# EAGLE design 6d (EAGLE 6.4)
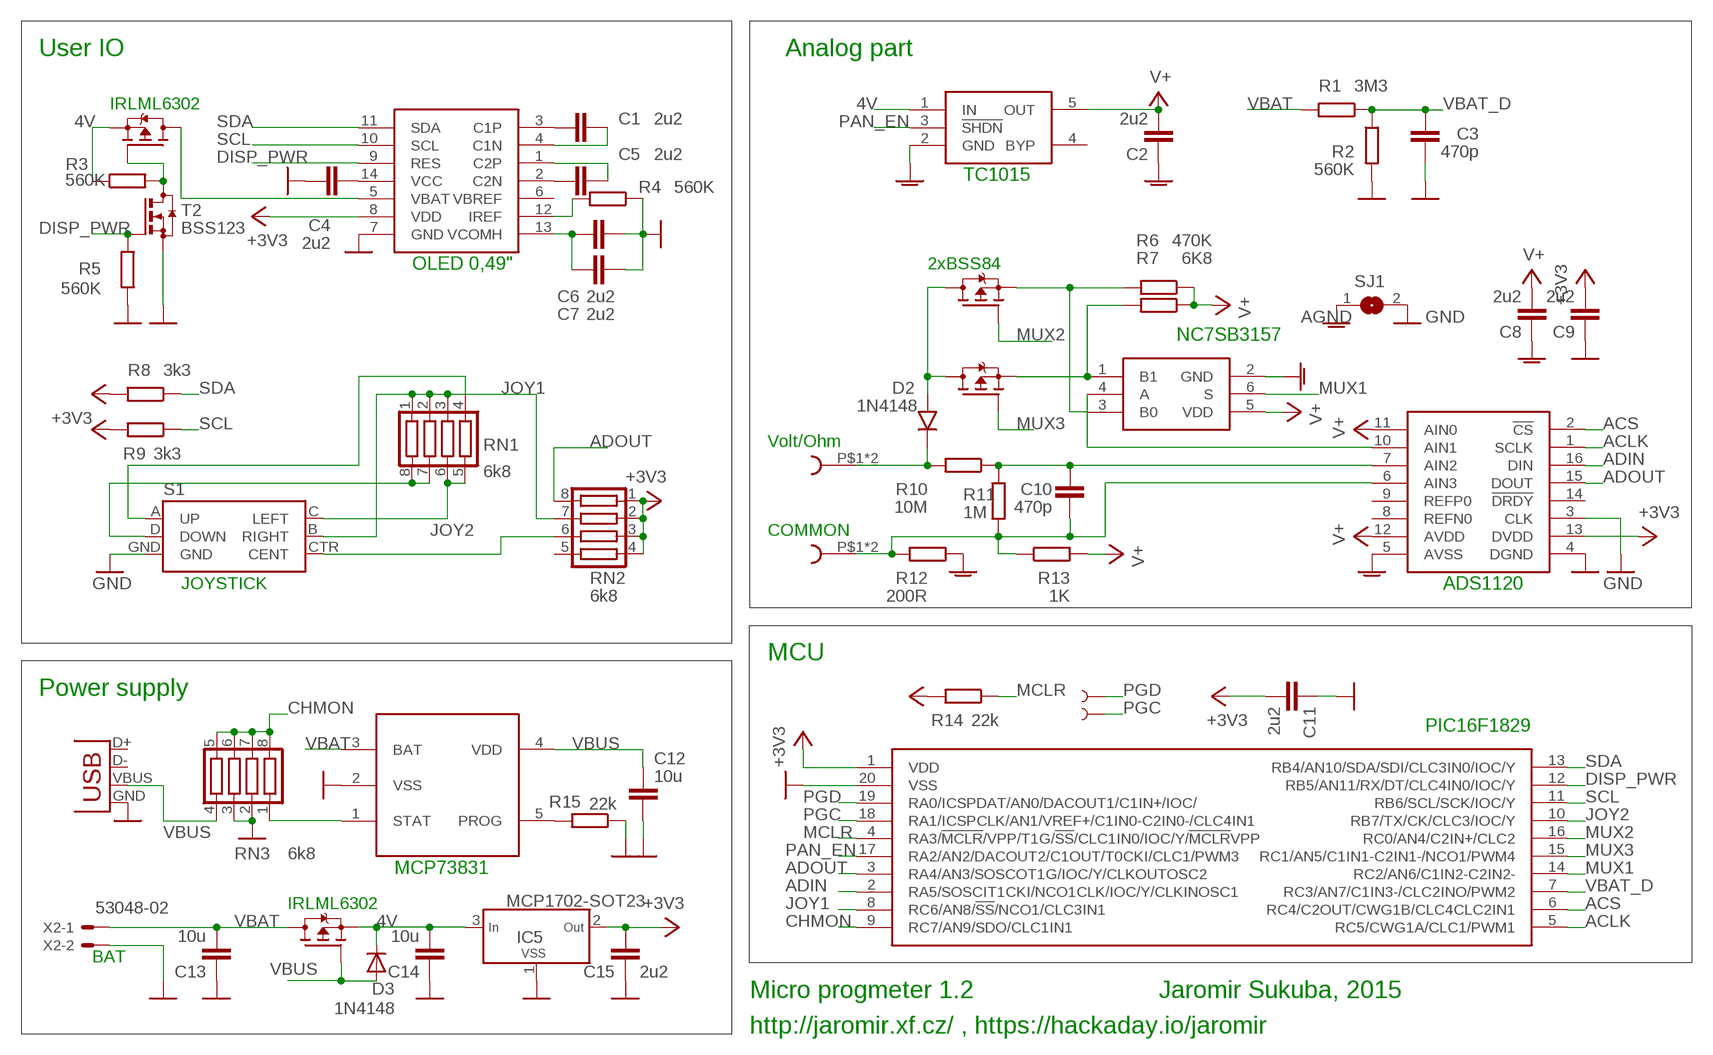
[diagram p0: schematic, sheet 1]

## Parts
C1  2u2  C_0603  [0603]
C2  2u2  C_0603  [0603]
C3  470p  C_0603  [0603]
C4  2u2  C_0603  [0603]
C5  2u2  C_0603  [0603]
C6  2u2  C_0603  [0603]
C7  2u2  C_0603  [0603]
C8  2u2  C_0603  [0603]
C9  2u2  C_0603  [0603]
C10  470p  C_0603  [0603]
C11  2u2  C_0603  [0603]
C12  10u  C_0806  [R0805]
C13  10u  C_0806  [R0805]
C14  10u  C_0806  [R0805]
C15  2u2  C_0603  [0603]
D1  DISP_OLED_049B  [DISP_OLED_049_B]
D2  1N4148  1N4148SOD  [SOD-80]
D3  1N4148  DIODE-SOD123  [SOD123]
IC1  TC1015  [SOT23-5]
IC2  NC7SB3157  [SC70-6]
IC3  ADS1120  [TSSOP16]
IC4  PIC16F1508SSOP20  [SSOP20]
IC5  MCP1702-SOT23  [SOT23]
R1  3M3  R_0603  [0603]
R2  560K  R_0603  [0603]
R3  560K  R_0603  [0603]
R4  560K  R_0603  [0603]
R5  560K  R_0603  [0603]
R6  470K  R_0805  [R0805]
R7  6K8  R_0805  [R0805]
R8  3k3  R_0603  [0603]
R9  3k3  R_0603  [0603]
R10  10M  R_0805  [R0805]
R11  1M  R_0805  [R0805]
R12  200R  R_0603  [0603]
R13  1K  R_0603  [0603]
R14  22k  R_0603  [0603]
R15  22k  R_0603  [0603]
RN1  6k8  CTS742C083  [CTS742C083]
RN2  6k8  CTS742C083  [CTS742C083]
RN3  6k8  CTS742C083  [CTS742C083]
S1  JOYSTICK_MINI  [JOYSTICK_MINI]
SJ1  SJ  [SJ]
T1  BSS84  [SOT23-3]
T2  BSS123  [SOT23]
T3  BSS84  [SOT23-3]
T4  BSS84  [SOT23-3]
T5  BSS84  [SOT23-3]
TP1  TEST-POINT3X5  [PAD.03X.05]
TP2  TEST-POINT3X5  [PAD.03X.05]
U$1  BANPLUG_2  [BANPLUG_2]
U$2  BANPLUG_2  [BANPLUG_2]
U$3  MCP73831  [SOT23-5]
X1  USB-MICROB  [USB-MICROB]
X2  53048-02  [53048-02]

## Nets
4V: C14.2 D3.C IC1.1(IN) IC5.3(IN) R3.1 T1.2(S) T5.2(S)
+3V3: C9.2 C11.2 C15.2 D1.8(VDD) IC3.13(DVDD) IC4.1(VDD) IC5.2(OUT) R8.2 R9.2 R14.2 RN2.1 RN2.2 RN2.3 RN2.4
ACLK: IC3.1(SCLK) IC4.5(RC5/CWG1A/CLC1/PWM1)
ACS: IC3.2(!CS) IC4.6(RC4/C2OUT/CWG1B/CLC4CLC2IN1)
ADIN: IC3.16(DIN) IC4.2(RA5/SOSCIT1CKI/NCO1CLK/IOC/Y/CLKINOSC1)
ADOUT: IC3.15(DOUT) IC4.3(RA4/AN3/SOSCOT1G/IOC/Y/CLKOUTOSC2) RN2.8
AGND: C2.1 C8.1 IC1.2(GND) IC2.2(GND) IC3.5(AVSS) R12.1 SJ1.1
CHMON: IC4.9(RC7/AN9/SDO/CLC1IN1) RN3.5 RN3.6 RN3.7 RN3.8
DISP_PWR: D1.9(RES) IC4.12(RB5/AN11/RX/DT/CLC4IN0/IOC/Y) R5.2 T2.1(G)
GND: C3.1 C4.1 C6.2 C7.2 C9.1 C11.1 C12.2 C13.1 C14.1 C15.1 D1.7(GND) IC3.3(CLK) IC3.4(DGND) IC4.20(VSS) IC5.1(VSS) R2.2 R4.1 R5.1 R15.1 RN3.2 RN3.3 S1.GND SJ1.2 T2.2(S) U$3.2(VSS) X1.GND X2.2
JOY1: IC4.8(RC6/AN8/!SS!/NCO1/CLC3IN1) RN1.1 RN1.2 RN1.3 RN2.7 S1.B(RIGHT)
JOY2: IC4.10(RB7/TX/CK/CLC3/IOC/Y) RN2.6 S1.CTR(CENT)
MCLR: IC4.4(RA3/!MCLR!/VPP/T1G/!SS!/CLC1IN0/IOC/Y/!MCLR!VPP) R14.1
MUX1: IC2.6(S) IC4.14(RC2/AN6/C1IN2-C2IN2-)
MUX2: IC4.16(RC0/AN4/C2IN+/CLC2) T3.1(G)
MUX3: IC4.15(RC1/AN5/C1IN1-C2IN1-/NCO1/PWM4) T4.1(G)
N$2: IC2.1(B1) R7.2 T4.2(S)
N$3: IC2.3(B0) R6.2 T3.2(S)
N$5: IC2.4(A) IC3.10(AIN1)
N$6: D2.K R10.2 U$1.P$1 U$1.P$2
N$7: R3.2 T1.1(G) T2.3(D)
N$8: C10.2 IC3.7(AIN2) R10.1 R11.1
N$9: RN3.1 U$3.1(STAT)
N$10: C10.1 IC3.6(AIN3) R11.2 R12.2 R13.1 U$2.P$1 U$2.P$2
N$11: C4.2 D1.14(VCC)
N$12: D1.5(VBAT) T1.3(D)
N$13: C6.1 C7.1 D1.13(VCOMH)
N$14: D1.12(IREF) R4.2
N$15: D2.A T3.3(D) T4.3(D)
N$17: RN1.4 S1.A(UP)
N$18: C1.1 D1.3(C1P)
N$19: C5.1 D1.2(C2N)
N$20: C5.2 D1.1(C2P)
N$21: C1.2 D1.4(C1N)
N$30: RN1.5 RN1.6 S1.C(LEFT)
N$33: RN1.7 RN1.8 S1.D(DOWN)
N$78: R15.2 U$3.5(PROG)
PAN_EN: IC1.3(!SHDN) IC4.17(RA2/AN2/DACOUT2/C1OUT/T0CKI/CLC1/PWM3)
PGC: IC4.18(RA1/ICSPCLK/AN1/VREF+/C1IN0-C2IN0-/CLC4IN1) TP2.P$1
PGD: IC4.19(RA0/ICSPDAT/AN0/DACOUT1/C1IN+/IOC/) TP1.P$1
SCL: D1.10(SCL) IC4.11(RB6/SCL/SCK/IOC/Y) R9.1
SDA: D1.11(SDA) IC4.13(RB4/AN10/SDA/SDI/CLC3IN0/IOC/Y) R8.1
V+: C2.2 C8.2 IC1.5(OUT) IC2.5(VDD) IC3.11(AIN0) IC3.12(AVDD) R6.1 R7.1 R13.2
VBAT: C13.2 R1.2 T5.3(D) U$3.3(BAT) X2.1
VBAT_D: C3.2 IC4.7(RC3/AN7/C1IN3-/CLC2INO/PWM2) R1.1 R2.1
VBUS: C12.1 D3.A RN3.4 T5.1(G) U$3.4(VDD) X1.VBUS
Unconnected: D1.6(VBREF) IC1.4(BYP) IC3.8(REFN0) IC3.9(REFP0) IC3.14(!DRDY) RN2.5 X1.D+ X1.D-

## Notes on the sheet
- User IO | Analog part
- IRLML6302
- TC1015
- OLED 0,49" | 2xBSS84
- NC7SB3157
- Volt/Ohm
- COMMON
- JOYSTICK | ADS1120
- MCU
- Power supply
- PIC16F1829
- MCP73831
- IRLML6302
- BAT
- Micro progmeter 1.2 | Jaromir Sukuba, 2015
- http://jaromir.xf.cz/ , https://hackaday.io/jaromir

## Library data of the parts
C1-C15 = _moja:C
D1 = _moja:DISP_OLED_049
D2 = _mcom5:1N4148
D3 = diode:DIODE-: DIODE
IC1 = _moja:TC1015
IC2 = _mcom5:NC7SB3157
IC3 = _mcom5:ADS1120
IC4 = _mcom5:PIC16F1508
IC5 = _mcom4:MCP1702
R1-R15 = _moja:R
RN1-RN3 = resistor-net:CTS742C083: Chip Resistor Array 4 Single Resistor Source: http://www.ctscorp.com/components/Datasheets/CTSChipArrayDs.pdf
S1 = SparkFun-Electromechanical:JOYSTICK_MINI: Small 5-way tactile joystick, COM-10063 4UCON SF303GJ26
SJ1 = jumper:SJ: SMD solder JUMPER
T1 T3-T5 = _moja:BSS84
T2 = transistor-small-signal:BSS123: N-CHANNEL MOS FET
TP1 TP2 = SparkFun:TEST-POINT
U$1 U$2 = _moja:BANPLUG_2
U$3 = _moja:MCP73831
X1 = SparkFun:USB: USB Connectors USB-B-PTH is fully proven SKU : PRT-00139 USB-miniB is fully proven SKU : PRT-00587 USB-A-PCB is untested. USB-A-H is throughly reviewed, but untested. Spark Fun Electronics SKU : PRT-00437 USB-B-SMT is throughly reviewed, but untested. Needs silkscreen touching up. USB-A-S has not been used/tested USB-MB-H has not been used/tested
X2 = con-molex:53?-02: CONNECTOR wire to board 1.25 mm (.049 inch) pitch header

## Board
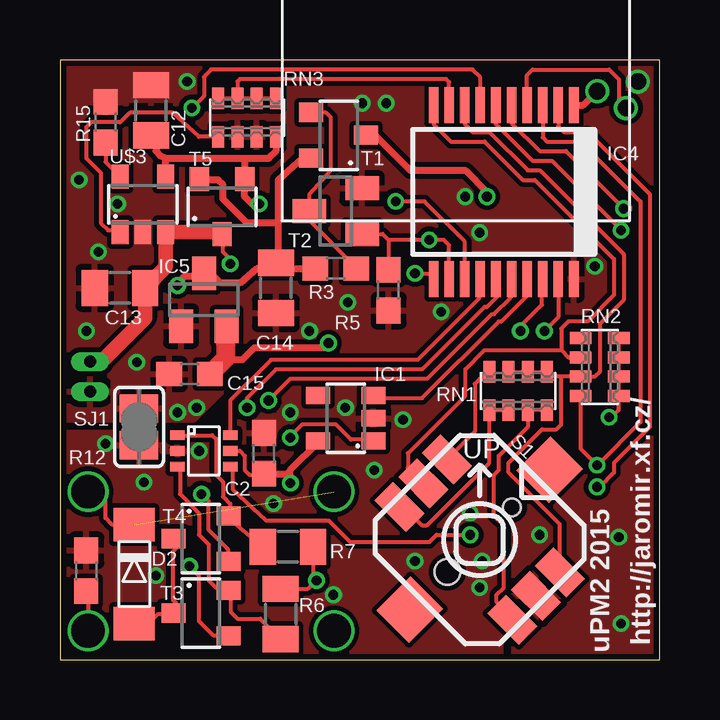
[diagram p1: board, top side]
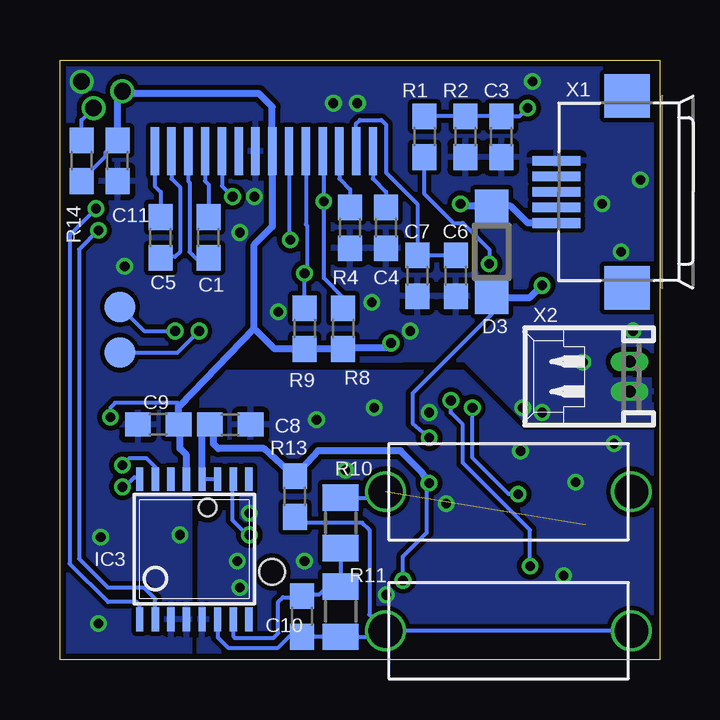
[diagram p2: board, bottom side, seen from below]

Size 25 x 25 mm. Coordinates in mm from the lower left corner, seen from the top.
Outline: 0,0 25,0 25,25 0,25 0,0
Copper layers (1*16): Top 0.035mm / dielectric 1.5mm / Bottom 0.035mm
Design rules "ch_6": minimum track width 0.15mm, minimum drill 0.4mm, track to track 0.2mm, track to pad 0.2mm, pad to pad 0.2mm, via to via 0.2mm, smd to smd 0.2mm, copper to edge 10mil, drill to drill 8mil, minimum pad ring 0.15mm, minimum via ring 0.15mm, stop-mask expansion 4mil, vias tented up to drill 0mil, thermal gap 10mil

### Footprints (pad centres in the part's own frame; a part is rotated, then mirrored left to right if it is on the bottom)
0603 = smd 1.067 x 1: 1 -0.85,0; 2 0.85,0
R0805 = smd 1.1 x 1.5: 1 -1.05,0; 2 1.05,0
DISP_OLED_049_B = smd 0.35 x 2 bottom: 1 4.55,-2.9; 2 3.85,-2.9; 3 3.15,-2.9; 4 2.45,-2.9; 5 1.75,-2.9; 6 1.05,-2.9; 7 0.35,-2.9; 8 -0.35,-2.9; 9 -1.05,-2.9; 10 -1.75,-2.9; 11 -2.45,-2.9; 12 -3.15,-2.9; 13 -3.85,-2.9; 14 -4.55,-2.9
SOD-80 = smd 1.397 x 1.702: A 1.905,0; K -2.223,0
SOD123 = smd 1.4 x 1.4: A 1.9,0; C -1.9,0
SOT23-5 = smd 0.7 x 1: 1 -0.99,-1.17; 2 -0.04,-1.17; 3 0.91,-1.17; 4 0.91,1.13; 5 -0.99,1.13
SC70-6 = smd 0.4 x 0.6: 1 -0.65,-1.1; 2 0,-1.1; 3 0.65,-1.1; 4 0.65,1.1; 5 0,1.1; 6 -0.65,1.1
TSSOP16 = smd 0.305 x 0.991: 1 -2.275,-2.918; 2 -1.625,-2.918; 3 -0.975,-2.918; 4 -0.325,-2.918; 5 0.325,-2.918; 6 0.975,-2.918; 7 1.625,-2.918; 8 2.275,-2.918; 9 2.275,2.918; 10 1.625,2.918; 11 0.975,2.918; 12 0.325,2.918; 13 -0.325,2.918; 14 -0.975,2.918; 15 -1.625,2.918; 16 -2.275,2.918
SSOP20 = smd 0.4 x 1.5: 1 -2.925,-3.625; 2 -2.275,-3.625; 3 -1.625,-3.625; 4 -0.975,-3.625; 5 -0.325,-3.625; 6 0.325,-3.625; 7 0.975,-3.625; 8 1.625,-3.625; 9 2.275,-3.625; 10 2.925,-3.625; 11 2.925,3.625; 12 2.275,3.625; 13 1.625,3.625; 14 0.975,3.625; 15 0.325,3.625; 16 -0.325,3.625; 17 -0.975,3.625; 18 -1.625,3.625; 19 -2.275,3.625; 20 -2.925,3.625
SOT23 = smd 1 x 1.4: 1 -0.95,-1.1; 2 0.95,-1.1; 3 0,1.1
CTS742C083 = smd 0.5 x 0.9: 1 -1.2,-0.8; 2 -0.4,-0.8; 3 0.4,-0.8; 4 1.2,-0.8; 5 1.2,0.8; 6 0.4,0.8; 7 -0.4,0.8; 8 -1.2,0.8
JOYSTICK_MINI = smd 1.85 x 1.1: A -3.325,1.4; B 3.325,1.4; C -3.325,-1.4; CTR -3.325,0; D 3.325,-1.4; GND 3.325,0 | smd 1.9 x 2: NC 0,4.13; NC@0 0,-4.13 | hole 0.75: 0,1.9 | hole 1.05: 0,-1.9
SJ = smd 1.168 x 1.6: 1 -0.762,0; 2 0.762,0
SOT23-3 = smd 0.8 x 1: 1 0.91,1.13; 2 -0.99,1.13; 3 -0.04,-1.17
PAD.03X.05 = smd 1.27 x 1.27: P$1 0,0
BANPLUG_2 = drill 1.4: P$1 -5.125,0; P$2 5.125,0
USB-MICROB = smd 0.4 x 2: D+ 0,3.1; D- -0.65,3.1; GND 1.3,3.1; ID 0.65,3.1; VBUS -1.3,3.1 | smd 1.8 x 1.9: GND@2 -4,0.15; GND@3 4,0.15
53048-02 = drill 0.5 pad 0.698 long: 1 0.625,-1.25; 2 -0.625,-1.25

### Placement (x,y rotation side)
C1  18.8,17.6 90 bottom
C2  8.5,8.6 270 top
C3  6.6,21.8 90 bottom
C4  11.4,18 90 bottom
C5  20.8,17.6 90 bottom
C6  8.5,16 270 bottom
C7  10.1,16 270 bottom
C8  17.9,9.8 180 bottom
C9  20.9,9.8 0 bottom
C10  14.9,1.8 90 bottom
C11  22.6,20.8 90 bottom
C12  3.8,22.9 90 top
C13  2.5,15.5 0 top
C14  9,15.5 90 top
C15  5.4,11.9 0 top
D1  16.5,24.1 0 top
D2  3.1,3.4 270 top
D3  7,17 90 bottom
IC1  11.9,10.1 90 top
IC2  6,8.7 270 top
IC3  19.4,4.6 0 bottom
IC4  18.5,19.5 180 top
IC5  6,15 0 top
R1  9.8,21.8 270 bottom
R2  8.1,21.8 270 bottom
R3  11.5,16.3 0 top
R4  12.9,18 90 bottom
R5  13.7,15.4 90 top
R6  9.2,1.9 270 top
R7  9.5,4.7 180 top
R8  13.2,13.8 270 bottom
R9  14.8,13.8 270 bottom
R10  13.3,5.7 90 bottom
R11  13.3,2 270 bottom
R12  1.1,3.7 270 top
R13  15.2,6.8 90 bottom
R14  24.1,20.8 270 bottom
R15  1.9,22.4 270 top
RN1  19.1,11.2 180 top
RN2  22.5,12.2 90 top
RN3  7.8,22.6 0 top
S1  17.5,5 315 top
SJ1  3.3,9.7 90 top
T1  11.6,21.9 90 top
T2  11.5,18.7 90 top
T3  5.9,1.9 270 top
T4  5.9,5 270 top
T5  6.8,18.9 0 top
TP1  22.5,14.7 0 bottom
TP2  22.5,12.8 0 bottom
U$1  6.3,7 180 bottom
U$2  6.3,1.2 0 bottom
U$3  3.5,19 0 top
X1  1.2,19.5 90 bottom
X2  2.5,11.8 90 bottom

### Tracks (layer width: path | path; a pad name or v marks a point on that pad's centre or on a via)
4V  (via drill 0.4)
  Top 0.16: IC1.1 12.67,9.17 12.13,9.17 11.5,9.8 10.1,9.8 9.6,9.3 v9.6,9.25 | 5.9,16 IC5.3
  Top 0.3: 8.95,16.3 8.2,16.3 7.5,15.7 6.7,15.7 6.4,16 6.1,16 IC5.3 | R3.1 9,16.3 C14.2 8.95,16.3 | T1.2 10.11,20.91 9.1,20 9.1,18.2 | v4.9,15.6 4.9,15.7 5.2,16 5.9,16 | 9.1,18.2 7.8,18.2 6.8,19.2 6.8,19.8 6.6,20 5.84,20 T5.2 6.04,20.1 | 9.1,18.2 9.1,16.45 8.95,16.3
  Bottom 0.16: 9.6,9.2 v9.6,9.25 10.3,9.85 10.3,11.1 7,14.4 D3.C
  Bottom 0.3: D3.C 5.4,15.1 v4.9,15.6
+3V3  (via drill 0.4, 0.7)
  Top 0.16: v22.9,10.1 23.3,10.4 RN2.1 RN2.2 RN2.3 RN2.4
  Top 0.3: 6.95,13.8 IC5.2 | IC4.1 21.82,23.12 v22.4,23.7 | 6.9,12.55 6.9,12.5 7.6,12.5 8.1,13 11,13 v11.2,13.2
  Top 0.8: 6.95,13.8 6.95,13.45 6.9,13.2 6.9,12.55 C15.2
  Bottom 0.16: 22.3,23.6 v22.4,23.7 | R14.2 24.1,20 23.1,21 23.1,21.15 C11.2 | 20,9.75 C9.2 | 20.05,10.6 20.05,10.65 20.1,10.7 22.7,10.7 22.9,10.5 v22.9,10.1
  Bottom 0.3: 22.3,23.6 16.7,23.6 16.15,23.05 D1.8 16.15,18.05 16.9,17.3 16.9,13.8 | C11.2 22.6,23.5 v22.4,23.7 | IC3.13 19.73,8.53 20,8.8 20,9.75 | C9.2 20.05,10.6 20,10.6 16.9,13.8 | v11.2,13.2 11.4,13 13.15,13 R8.2 R9.2 16.05,12.95 16.9,13.8
ACLK  (via drill 0.4)
  Top 0.16: IC4.5 18.82,22.38 20,21.2 21.1,21.2 v23.5,18.8
  Bottom 0.16: v23.5,18.8 24.6,17.7 24.6,4 23,2.4 21.8,2.4 21.68,2.27 IC3.1
ACS  (via drill 0.4)
  Top 0.16: IC4.6 18.18,22.32 19.7,20.8 20.5,20.8 v23.4,17.9
  Bottom 0.16: v23.4,17.9 24.2,17.1 24.2,4.2 23,3 21.5,3 21.02,2.52 IC3.2
ADIN  (via drill 0.4)
  Top 0.16: IC4.2 20.77,22.23 21,22 22,22 24.6,19.4 24.6,9.7 23.1,8.2 23.1,7.8 22.5,7.2 v22.4,7.2
  Bottom 0.16: v22.4,7.2 22.3,7.2 21.9,7.6 21.76,7.6 IC3.16
ADOUT  (via drill 0.4)
  Top 0.16: IC4.3 20.12,21.77 20.3,21.6 21.7,21.6 24.2,19.1 24.2,9.9 v22.4,8.1 21.7,8.8 RN2.8
  Bottom 0.16: v22.4,8.1 22.4,8.2 22.1,8.4 21.4,8.4 21.02,8.03 IC3.15
AGND  (via drill 0.4)
  other vias: 1.9,9 5.8,8.7 9.6,10.3 4,3.5 11.4,2.7 3.5,7.4 17.5,3 11.9,10.5 14.3,10 8.9,6.5 17.6,4.1 14.8,4.1 17.1,6.1 13.1,7.9
  pour Top: 0,0 18.4,0 18.4,12 9,12 6.5,9.5 0,9.5
  pour Bottom: 0,0 19.2,0 19.1,11.2 18.3,12 8.2,12 5.7,9.5 0,9.5
  pour Top (no thermals): 8.1,10.2 8.1,9.3 9.2,9.3 9.4,9.5 9.4,10.2
CHMON
  Top 0.16: RN3.7 7.4,24.1 7.5,24.2 16.1,24.2 16.23,24.07 IC4.9 | RN3.8 RN3.7 | RN3.7 RN3.6 RN3.5
DISP_PWR  (via drill 0.4)
  Top 0.16: IC4.12 16.23,17.27 16,17.5 v15.4,17.5 13.7,17.5 | 13.7,17.5 R5.2 | T2.1 13.45,17.75 13.7,17.5
  Bottom 0.16: D1.9 15.45,17.55 v15.4,17.5
GND  (via drill 0.4, 0.7)
  other vias: 5.7,10.5 1.6,17 12,14.9 0.8,20 1.1,13.7 3.2,12.4 4.9,10.3 2.4,19 16.9,19.3 24.1,24.1 13.6,23.2 17.5,17.8 23.3,5.1 23.4,1.5 5.3,24.1 22.3,16.4 20,5.2 15.9,14.5 12.6,23.2 10.4,13.7
  pour Top: 0,10 5.6,10 8.1,12.5 18.9,12.5 18.9,0 25,0 25,25 0,25
  pour Bottom: 0,10 5.6,10 8.1,12.5 18.6,12.4 18.8,12.4 19.6,11.6 19.6,0 25,0 25,25 0,25
  pour Bottom (no thermals): 0.4,10.5 2.4,10.5 2.4,11.7 0.4,11.7
  pour Top (no thermals): 1,23.3 5.1,23.3 5.1,24.7 1,24.7
  pour Top (no thermals): 4.4,16.8 4.4,18.8 1.8,18.8 1.8,16.8
  pour Top (no thermals): 2.3,11.8 2.3,10.6 2.2,10.6 2.2,11.1 1.8,11.1 1.8,11.2 2.2,11.2 2.2,11.8
JOY1
  Top 0.16: RN1.3 RN1.2 RN1.1 20.4,11.8 20.9,11.8 | S1.B 20.84,5.64 18.7,7.8 18.7,8.2 20.1,9.6 20.7,9.6 20.9,9.8 20.9,11.8 | 20.9,11.8 RN2.7 22.3,11.8 22.5,12 22.5,14 23.5,15 23.5,16.9 20,20.4 19.5,20.4 17.9,22 17.2,22 16.88,22.32 IC4.8
JOY2
  Top 0.16: S1.CTR 14.5,8 14.5,8.6 16.9,11 16.9,12.1 17.7,12.9 20.9,12.9 | IC4.10 15.57,22.32 16.3,21.6 17.7,21.6 19.3,20 19.8,20 23.1,16.7 23.1,15.2 22,14.1 21.2,14.1 20.9,13.8 20.9,12.9 | 20.9,12.9 21.2,12.6 RN2.6
MCLR  (via drill 0.7)
  Top 0.16: IC4.4 19.48,24.38 19.7,24.6 22.9,24.6 23.3,24.2 23.3,23.3 v23.6,23
  Bottom 0.16: R14.1 24.1,22.5 v23.6,23
MUX1
  Top 0.16: IC2.6 7.1,10.8 8.8,12.5 14.9,12.5 17.5,15.1 17.5,15.85 IC4.14
MUX2  (via drill 0.4)
  Top 0.16: v8.7,10.8 9.6,11.7 15.3,11.7 18,14.4 18.1,14.4 18.8,15.1 18.8,15.85 IC4.16 | T3.1 6.41,0.99 5.8,1.6 5.8,3.5 v5.4,3.9
  Bottom 0.16: v8.7,10.8 8.7,10.3 8.2,9.8 8.2,8.2 5.4,5.4 v5.4,3.9
MUX3  (via drill 0.4)
  Top 0.16: v7.8,10.5 7.8,10.9 9,12.1 15.1,12.1 17.7,14.7 17.8,14.7 18.2,15.1 18.2,15.85 IC4.15 | T4.1 7.03,4.57 6.2,5.4 6.2,6.6 v5.9,6.9
  Bottom 0.16: v7.8,10.5 7.8,8.4 6.3,6.9 v5.9,6.9
N$2
  Top 0.16: IC2.1 6.35,9.35 6.5,9.2 6.5,7.7 6.8,7.4 6.8,6.8 7.1,6.5 7.1,6.02 | 7.1,6.02 T4.2 | 7.1,6.02 7.1,5.85 R7.2
N$3
  Top 0.16: IC2.3 5,7.95 5,6.9 5.8,6.1 5.8,5.2 6.2,4.8 6.2,3.3 6.5,3 7.02,3 T3.2 7.12,2.9 7.12,1.98 7.4,1.7 8.35,1.7 R6.2
N$5  (via drill 0.4)
  Top 0.16: IC2.4 7.15,8.05 7.2,8 7.2,7.1 8.6,5.8 11.2,5.8 12.1,4.9 15.4,4.9 15.7,5.2 v17.1,5.2
  Bottom 0.16: v17.1,5.2 17.2,5.2 17.8,5.8 17.8,7.49 IC3.10
N$6  (1 unrouted)
  Top 0.16: D2.K 2.18,5.62 1.9,5.9 1.9,6.8 1.7,7 U$1.P$1
  Bottom 0.16: R10.2 11.68,6.75 U$1.P$2
N$7
  Top 0.16: R3.2 12.35,16.35 10.4,18.3 T2.3 10.4,19.4 11.3,20.4 11.3,22.6 11.1,22.8 T1.1
N$8
  Bottom 0.16: IC3.7 17.77,0.97 17.7,0.9 16.1,0.9 15.9,1.1 15.9,2.4 15.7,2.6 14.95,2.6 C10.2 14.85,2.7 14.2,2.7 13.85,3.05 R11.1 R10.1
N$9
  Top 0.16: RN3.1 5.8,21.8 4.7,22.8 2.9,22.8 2.5,22.4 1.3,22.4 1.1,22.2 1.1,20.9 1.7,20.3 1.7,18.2 2,17.9 2.3,17.9 U$3.1
N$10
  Top 0.16: R12.2 1.07,2.65 1.1,2.6 1.18,2.52 U$2.P$2
  Bottom 0.16: IC3.6 18.43,0.93 18,0.5 15.9,0.5 15.4,1 14.95,1 C10.1 R11.2 11.68,0.95 U$2.P$1 | U$2.P$1 12.1,1.88 12.1,5.4 12.4,5.7 14.75,5.7 R13.1 | U$2.P$2 U$2.P$1
N$11
  Bottom 0.16: D1.14 11.95,20.05 11.4,19.5 C4.2
N$12  (via drill 0.4)
  Top 0.16: 12.81,21.9 T1.3
  Top 0.3: 12.81,21.9 13.1,21.9 14.6,20.4 16.9,20.4 17.8,19.5 v17.8,19.3
  Bottom 0.16: D1.5 18.25,19.75 v17.8,19.3
N$13
  Bottom 0.16: C6.1 C7.1 10.1,19 11.4,20.3 11.4,22.3 11.6,22.5 12.5,22.5 12.65,22.35 D1.13
N$14
  Bottom 0.16: D1.12 13.35,20.05 12.9,19.6 R4.2
N$15
  Top 0.16: T4.3 4.83,4.63 4.7,4.5 4.7,2.5 4.83,2.37 T3.3 4.79,1.9 4.1,1.9 3.69,1.5 D2.A
N$17
  Top 0.16: RN1.4 17.5,11.7 17.3,11.5 17.3,9.5 S1.A
N$18
  Bottom 0.16: D1.3 19.65,19.95 19.6,19.9 19.6,17 19.3,16.7 18.95,16.7 C1.1
N$19
  Bottom 0.16: D1.2 20.35,20.05 20,19.7 20,17 20.2,16.8 20.85,16.8 C5.1
N$20
  Bottom 0.16: D1.1 21.05,19.75 20.8,19.5 C5.2
N$21
  Bottom 0.16: D1.4 18.95,19.95 18.8,19.8 C1.2
N$30
  Top 0.16: RN1.6 RN1.5 17.9,8.2 15.3,5.6 15.1,5.6 14.34,6.36 S1.C
N$33
  Top 0.16: S1.D 18.86,1.74 18.2,2.4 18.2,2.7 18.5,3 18.5,5.6 18.1,6 18.1,7.7 18.3,7.9 18.3,8.5 19.5,9.7 RN1.7 RN1.8
N$78
  Top 0.16: R15.2 1.9,20.74 U$3.5
PAN_EN
  Top 0.16: IC1.3 13.07,10.77 13.2,10.9 15.1,10.9 18.3,14.1 18.4,14.1 19.5,15.2 19.5,15.85 IC4.17
PGC  (via drill 0.4)
  Top 0.16: v19.2,13.7 19.2,13.9 20.1,14.8 20.1,15.85 IC4.18
  Bottom 0.16: TP2.P$1 20.1,12.8 v19.2,13.7
PGD  (via drill 0.4)
  Top 0.16: IC4.19 20.77,14.28 v20.2,13.7
  Bottom 0.16: TP1.P$1 21.5,13.7 v20.2,13.7
SCL  (via drill 0.4)
  Top 0.16: v14.8,16.1 15.5,16.1 IC4.11
  Bottom 0.16: D1.10 14.75,18.15 14.7,18.1 14.7,16.2 v14.8,16.1 R9.1
SDA  (via drill 0.4)
  Top 0.16: IC4.13 16.88,17.43 15.2,19.1 v14,19.1
  Bottom 0.16: D1.11 14,21.15 v14,19.1 14,15.9 13.2,15.1 R8.1
V+  (via drill 0.4)
  Top 0.16: IC2.5 7.5,8.7 7.7,8.5 7.7,7.9 7.9,7.7 8.45,7.7 C2.2 | R6.1 10.35,2.95 v10.7,3.3 10.55,3.35 R7.1
  Top 0.3: C2.2 9.45,7.75 9.6,7.6 v9.61,7.35 v9.6,7.36 9.6,7.9 10.8,9.1 IC1.5
  Bottom 0.16: 18.6,9.75 C8.2 19.07,9.47 | IC3.11 IC3.12 | v10.7,3.3 10.7,4.3 9.7,5.3 9.7,7.34 v9.61,7.35
  Bottom 0.3: v9.61,7.35 9.91,7.81 10.8,8.7 14.25,8.7 R13.2 15.25,7.65 16.5,8.8 18.4,8.8 18.6,9 18.6,9.75 | IC3.12 19.07,9.47
VBAT  (via drill 0.4)
  Top 0.16: v7.1,16.5 7.1,16.7 6.8,17 6.8,17.69 T5.3
  Top 0.6: T5.3 6.7,17.8 6.67,17.83 U$3.3 4.41,16.36 C13.2 3.55,14.24 1.74,12.43 X2.1
  Bottom 0.16: v7.1,16.5 7.1,17.1 8.2,18.2 8.6,18.2 9.8,19.4 R1.2
VBAT_D  (via drill 0.4)
  Top 0.16: IC4.7 17.52,24.27 17.2,24.6 6.3,24.6 6,24.3 6,23.5 v5.5,23
  Bottom 0.16: v5.5,23 5.85,22.65 C3.2 R2.1 R1.1
VBUS  (via drill 0.4)
  Top 0.3: 4.43,20.13 U$3.4 4.41,20.31 4.4,20.5 4.4,20.9 | 4.4,20.9 7.7,20.9 | 7.7,20.9 8.7,20.9 9,21.2 RN3.4 | C12.1 3.95,21.85 4,21.7 4,21.2 4.2,21 4.4,20.9 | 7.7,20.9 7.71,20.89 T5.1 7.7,19.3 8,19 v8.3,19
  Bottom 0.3: X1.VBUS 5.5,18.2 6.2,18.9 D3.A 8.2,18.9 v8.3,19

### Text on the board
tNames: http://jaromir.xf.cz/ | uPM2 2015